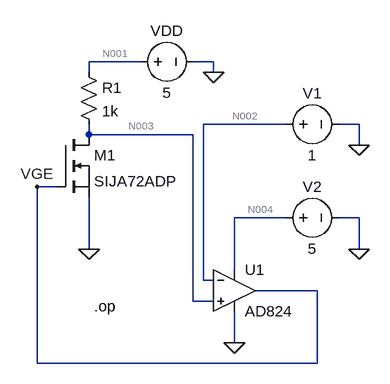
[diagram p0: schematic mosfet_param.asc]
mosfet_param.asc, the LTspice schematic file:
Version 4.1
SHEET 1 880 680
WIRE 96 -48 16 -48
WIRE 208 -48 176 -48
WIRE 16 -32 16 -48
WIRE 208 -32 208 -48
WIRE 320 48 192 48
WIRE 432 48 400 48
WIRE 16 64 16 48
WIRE 176 64 16 64
WIRE 432 80 432 48
WIRE -32 144 -64 144
WIRE 320 192 240 192
WIRE 432 192 400 192
WIRE 16 240 16 160
WIRE 432 240 432 192
WIRE 240 272 240 192
WIRE 192 288 192 48
WIRE 208 288 192 288
WIRE 368 304 272 304
WIRE 176 320 176 64
WIRE 208 320 176 320
WIRE 240 384 240 336
WIRE -64 416 -64 144
WIRE 368 416 368 304
WIRE 368 416 -64 416
FLAG 208 -32 0
FLAG 16 240 0
FLAG -64 144 VGE
FLAG 432 80 0
FLAG 432 240 0
FLAG 240 384 0
SYMBOL nmos -32 64 R0
SYMATTR InstName M1
SYMATTR Value SIJA72ADP
SYMBOL voltage 80 -48 R270
WINDOW 0 32 56 VTop 2
WINDOW 3 -32 56 VBottom 2
WINDOW 123 0 0 Left 0
WINDOW 39 0 0 Left 0
SYMATTR InstName VDD
SYMATTR Value 5
SYMBOL res 0 -48 R0
SYMATTR InstName R1
SYMATTR Value 1k
SYMBOL OpAmps\\AD824 240 240 R0
SYMATTR InstName U1
SYMBOL voltage 304 48 R270
WINDOW 0 32 56 VTop 2
WINDOW 3 -32 56 VBottom 2
WINDOW 123 0 0 Left 0
WINDOW 39 0 0 Left 0
SYMATTR InstName V1
SYMATTR Value 1
SYMBOL voltage 304 192 R270
WINDOW 0 32 56 VTop 2
WINDOW 3 -32 56 VBottom 2
WINDOW 123 0 0 Left 0
WINDOW 39 0 0 Left 0
SYMATTR InstName V2
SYMATTR Value 5
TEXT 24 328 Left 2 !.op

The netlist it stands for:
* mosfet_param.asc
M1 N003 VGE 0 0 SIJA72ADP
VDD N001 0 5
R1 N001 N003 1k
X§U1 N003 N002 N004 0 VGE AD824  ; pins In+ In- V+ V- OUT
V1 N002 0 1
V2 N004 0 5
.model NMOS NMOS
.model PMOS PMOS
.lib standard.mos
.op
.backanno
.end

* Results of the author's LTspice run, read from the files saved beside the schematic
* Operating Point:
*   V(vge) = 1.39 V
*   V(n002) = 1 V
*   V(n004) = 5 V
*   V(n003) = 1 V
*   V(n001) = 5 V
*   Id(M1) = 4 mA
*   Ig(M1) = -214 pA
*   Is(M1) = -4 mA
*   I(R1) = 4 mA
*   I(V2) = -661.6 µA
*   I(VDD) = -4 mA
*   I(V1) = -1.925 pA
*   Ix(u1:1) = 1.925 pA
*   Ix(u1:2) = 1.925 pA
*   Ix(u1:3) = 661.6 µA
*   Ix(u1:4) = -661.6 µA
*   Ix(u1:5) = 0 A